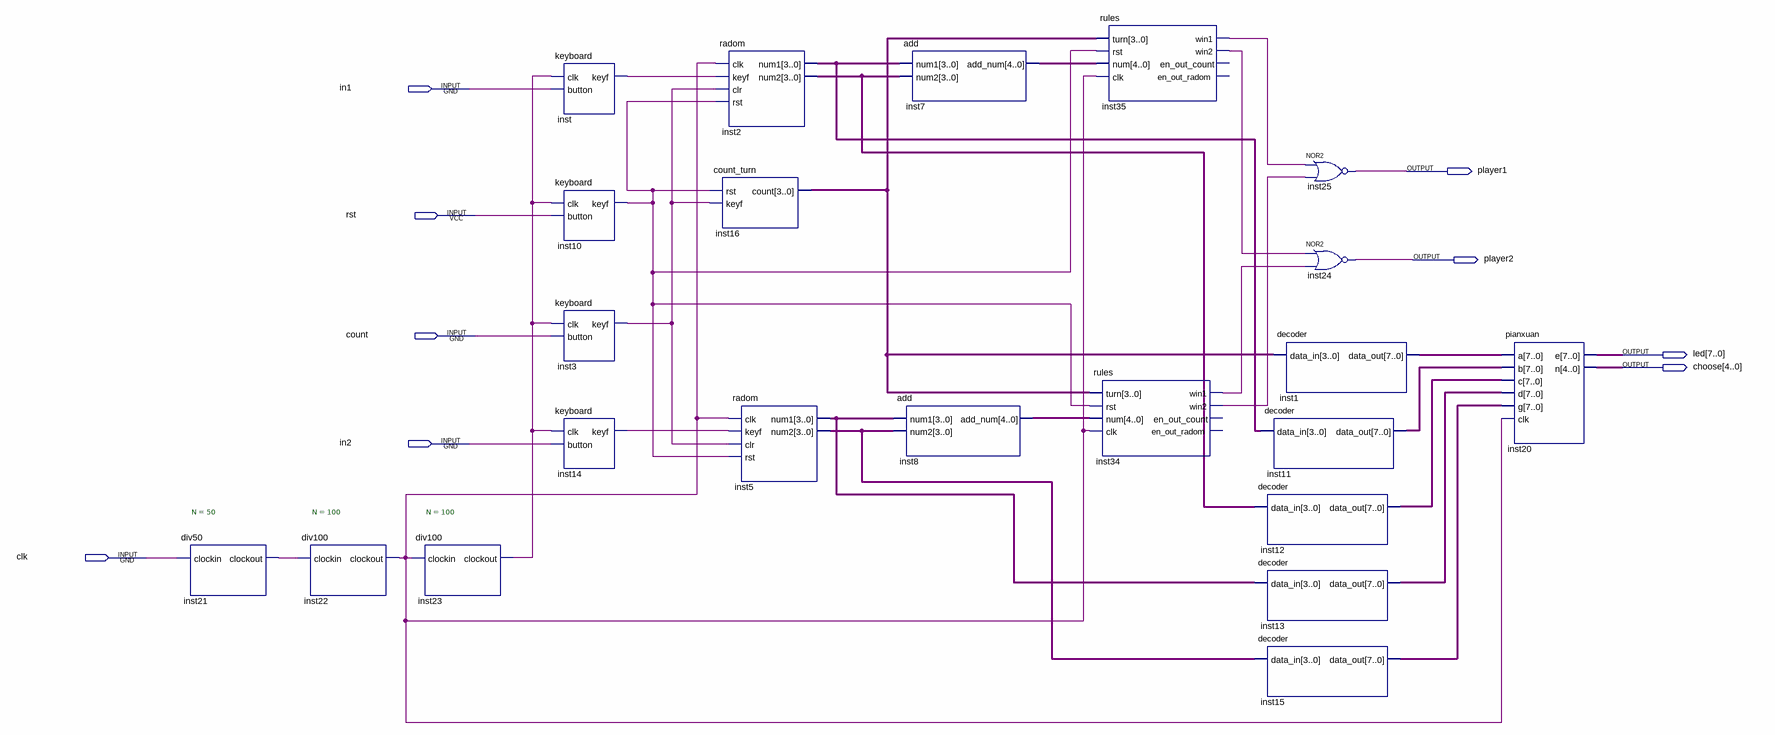
[diagram p0: schematic sheet]
// Quartus schematic dicegame.bdf as structural Verilog: 22 symbols, 9 pins
module dicegame (
  input  in1,
  input  rst,
  input  count,
  input  in2,
  input  clk,
  output player1,
  output player2,
  output [7:0] led,
  output [4:0] choose
);

  wire inst3_keyf, inst10_keyf, inst14_keyf, inst21_clockout, inst22_clockout, inst23_clockout, inst34_win1,
       inst34_win2, inst35_win1, inst35_win2, inst_keyf;
  wire [3:0] inst2_num1, inst2_num2, inst5_num1, inst5_num2, inst16_count;
  wire [4:0] inst7_add_num, inst8_add_num;
  wire [7:0] inst1_data_out, inst11_data_out, inst12_data_out, inst13_data_out, inst15_data_out;

  div50 #(.N(50)) inst21 (.clockin(clk), .clockout(inst21_clockout));
  div100 #(.N(100)) inst22 (.clockin(inst21_clockout), .clockout(inst22_clockout));
  div100 #(.N(100)) inst23 (.clockin(inst22_clockout), .clockout(inst23_clockout));
  keyboard inst (.clk(inst23_clockout), .button(in1), .keyf(inst_keyf));
  keyboard inst10 (.clk(inst23_clockout), .button(rst), .keyf(inst10_keyf));
  keyboard inst3 (.clk(inst23_clockout), .button(count), .keyf(inst3_keyf));
  keyboard inst14 (.clk(inst23_clockout), .button(in2), .keyf(inst14_keyf));
  radom inst2 (
    .clk(inst22_clockout), .keyf(inst_keyf), .clr(inst3_keyf), .rst(inst10_keyf), .num1(inst2_num1),
    .num2(inst2_num2));
  count_turn inst16 (.rst(inst10_keyf), .keyf(inst3_keyf), .count(inst16_count));
  radom inst5 (
    .clk(inst22_clockout), .keyf(inst14_keyf), .clr(inst3_keyf), .rst(inst10_keyf), .num1(inst5_num1),
    .num2(inst5_num2));
  add inst7 (.num1(inst2_num1), .num2(inst2_num2), .add_num(inst7_add_num));
  add inst8 (.num1(inst5_num1), .num2(inst5_num2), .add_num(inst8_add_num));
  rules inst35 (
    .turn(inst16_count), .rst(inst10_keyf), .num(inst7_add_num), .clk(inst22_clockout), .win1(inst35_win1),
    .win2(inst35_win2));  // open: en_out_count, en_out_radom
  rules inst34 (
    .turn(inst16_count), .rst(inst10_keyf), .num(inst8_add_num), .clk(inst22_clockout), .win1(inst34_win1),
    .win2(inst34_win2));  // open: en_out_count, en_out_radom
  decoder inst1 (.data_in(inst16_count), .data_out(inst1_data_out));
  decoder inst11 (.data_in(inst2_num1), .data_out(inst11_data_out));
  decoder inst12 (.data_in(inst2_num2), .data_out(inst12_data_out));
  decoder inst13 (.data_in(inst5_num1), .data_out(inst13_data_out));
  decoder inst15 (.data_in(inst5_num2), .data_out(inst15_data_out));
  nor inst25 (player1, inst35_win1, inst34_win2);
  nor inst24 (player2, inst35_win2, inst34_win1);
  pianxuan inst20 (
    .a(inst1_data_out), .b(inst11_data_out), .c(inst12_data_out), .d(inst13_data_out), .g(inst15_data_out),
    .clk(inst22_clockout), .e(led), .n(choose));
endmodule
